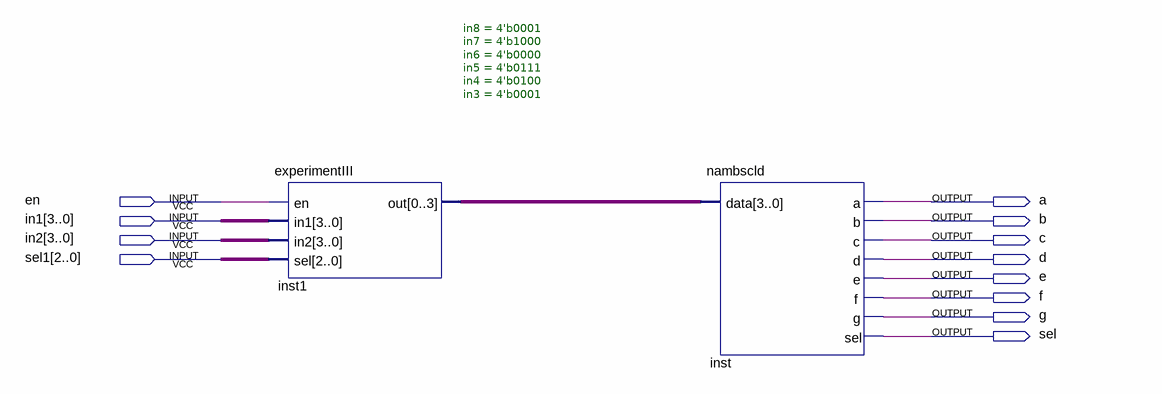
[diagram p0: schematic sheet]
// Quartus schematic a31.bdf as structural Verilog: 2 symbols, 12 pins
module a31 (
  input  en,
  input  [3:0] in1,
  input  [3:0] in2,
  input  [2:0] sel1,
  output a,
  output b,
  output c,
  output d,
  output e,
  output f,
  output g,
  output sel
);

  wire [3:0] inst1_out;

  experimentIII #(.in8(4'b0001), .in7(4'b1000), .in6(4'b0000), .in5(4'b0111), .in4(4'b0100), .in3(4'b0001)) inst1 (
    .en(en), .in1(in1), .in2(in2), .sel(sel1), .out(inst1_out));
  nambscld inst (.data(inst1_out), .a(a), .b(b), .c(c), .d(d), .e(e), .f(f), .g(g), .sel(sel));
endmodule
